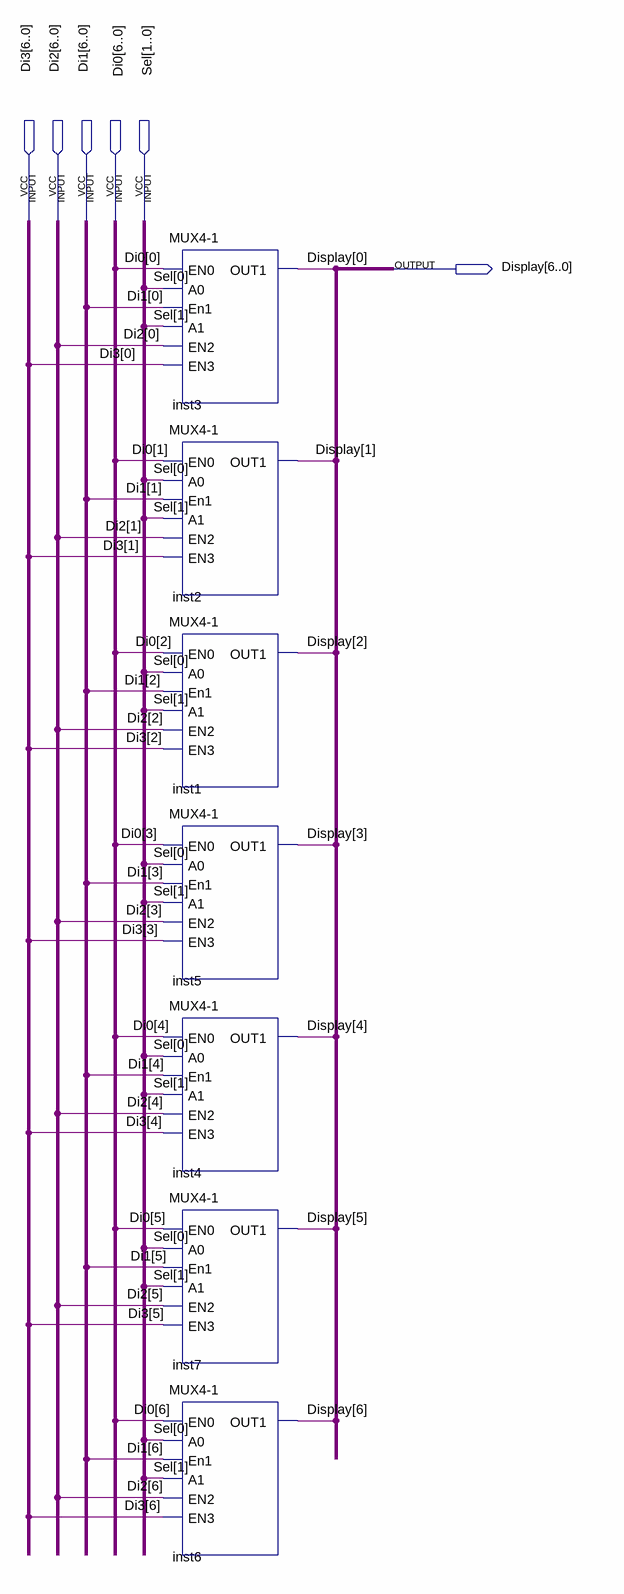
[diagram p0: schematic sheet]
// Quartus schematic Sept4x1Mutiplexer.bdf as structural Verilog: 7 symbols, 6 pins
module Sept4x1Mutiplexer (
  input  [6:0] Di3,
  input  [6:0] Di2,
  input  [6:0] Di1,
  input  [6:0] Di0,
  input  [1:0] Sel,
  output [6:0] Display
);

  \MUX4-1  inst3 (.EN0(Di0[0]), .A0(Sel[0]), .En1(Di1[0]), .A1(Sel[1]), .EN2(Di2[0]), .EN3(Di3[0]), .OUT1(Display[0]));
  \MUX4-1  inst2 (.EN0(Di0[1]), .A0(Sel[0]), .En1(Di1[1]), .A1(Sel[1]), .EN2(Di2[1]), .EN3(Di3[1]), .OUT1(Display[1]));
  \MUX4-1  inst1 (.EN0(Di0[2]), .A0(Sel[0]), .En1(Di1[2]), .A1(Sel[1]), .EN2(Di2[2]), .EN3(Di3[2]), .OUT1(Display[2]));
  \MUX4-1  inst5 (.EN0(Di0[3]), .A0(Sel[0]), .En1(Di1[3]), .A1(Sel[1]), .EN2(Di2[3]), .EN3(Di3[3]), .OUT1(Display[3]));
  \MUX4-1  inst4 (.EN0(Di0[4]), .A0(Sel[0]), .En1(Di1[4]), .A1(Sel[1]), .EN2(Di2[4]), .EN3(Di3[4]), .OUT1(Display[4]));
  \MUX4-1  inst7 (.EN0(Di0[5]), .A0(Sel[0]), .En1(Di1[5]), .A1(Sel[1]), .EN2(Di2[5]), .EN3(Di3[5]), .OUT1(Display[5]));
  \MUX4-1  inst6 (.EN0(Di0[6]), .A0(Sel[0]), .En1(Di1[6]), .A1(Sel[1]), .EN2(Di2[6]), .EN3(Di3[6]), .OUT1(Display[6]));
endmodule
